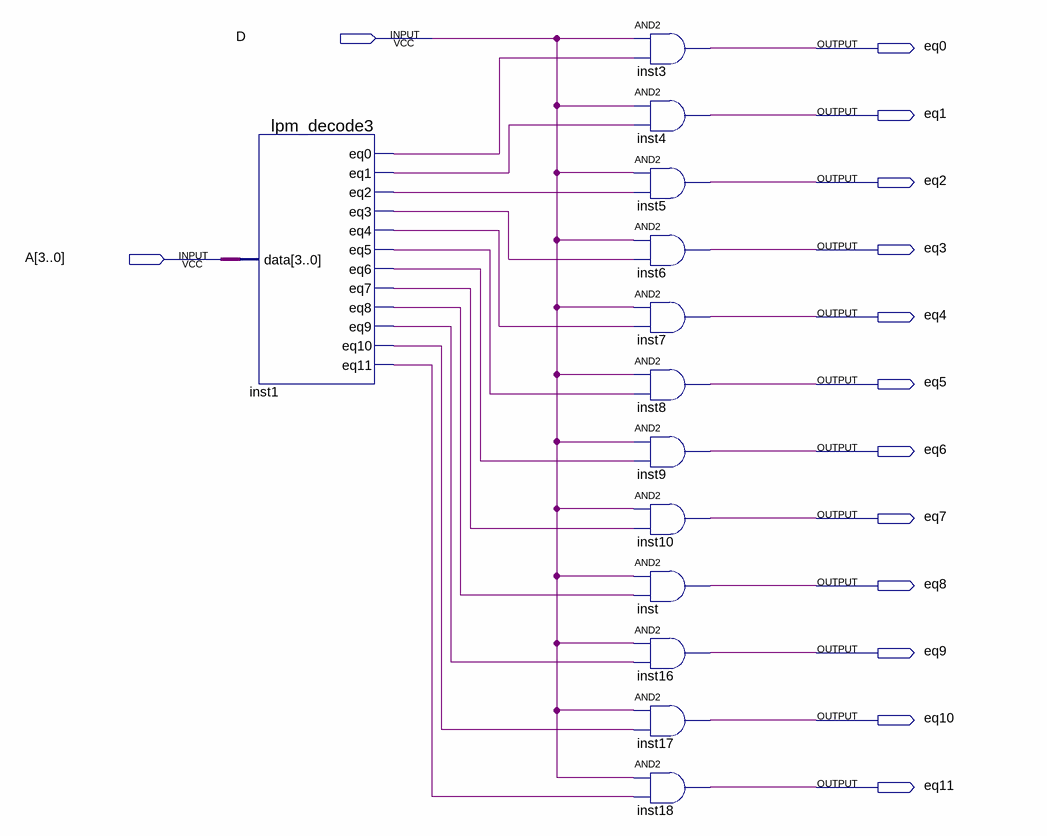
[diagram p0: schematic sheet]
// Quartus schematic dmx4to12.bdf as structural Verilog: 13 symbols, 14 pins
module dmx4to12 (
  input  D,
  input  [3:0] A,
  output eq0,
  output eq1,
  output eq2,
  output eq3,
  output eq4,
  output eq5,
  output eq6,
  output eq7,
  output eq8,
  output eq9,
  output eq10,
  output eq11
);

  wire inst1_eq0, inst1_eq1, inst1_eq2, inst1_eq3, inst1_eq4, inst1_eq5, inst1_eq6, inst1_eq7, inst1_eq8,
       inst1_eq9, inst1_eq10, inst1_eq11;

  lpm_decode3 inst1 (
    .data(A), .eq0(inst1_eq0), .eq1(inst1_eq1), .eq2(inst1_eq2), .eq3(inst1_eq3), .eq4(inst1_eq4),
    .eq5(inst1_eq5), .eq6(inst1_eq6), .eq7(inst1_eq7), .eq8(inst1_eq8), .eq9(inst1_eq9), .eq10(inst1_eq10),
    .eq11(inst1_eq11));
  and inst3 (eq0, D, inst1_eq0);
  and inst4 (eq1, D, inst1_eq1);
  and inst5 (eq2, D, inst1_eq2);
  and inst6 (eq3, D, inst1_eq3);
  and inst7 (eq4, D, inst1_eq4);
  and inst8 (eq5, D, inst1_eq5);
  and inst9 (eq6, D, inst1_eq6);
  and inst10 (eq7, D, inst1_eq7);
  and inst (eq8, D, inst1_eq8);
  and inst16 (eq9, D, inst1_eq9);
  and inst17 (eq10, D, inst1_eq10);
  and inst18 (eq11, D, inst1_eq11);
endmodule
